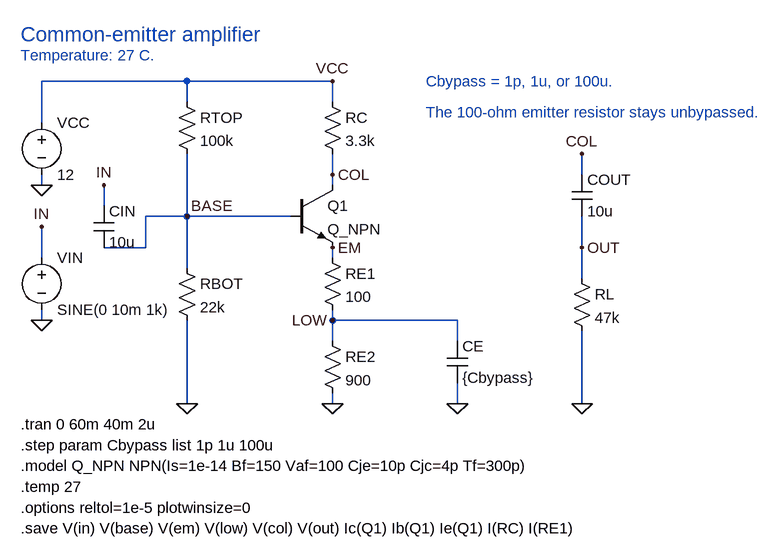
[diagram p0: schematic common-emitter-amplifier.asc]
common-emitter-amplifier.asc, the LTspice schematic file:
Version 4
SHEET 1 1280 1000
WIRE 80 160 80 96
WIRE 80 96 304 96
WIRE 304 96 528 96
WIRE 528 96 528 128
WIRE 304 96 304 128
WIRE 80 240 80 256
WIRE 304 208 304 304
WIRE 304 304 464 304
WIRE 304 304 304 384
WIRE 176 288 176 256
WIRE 176 352 240 352
WIRE 240 352 240 304
WIRE 240 304 304 304
WIRE 80 368 80 320
WIRE 80 448 80 464
WIRE 528 208 528 240
WIRE 528 240 528 256
WIRE 528 352 528 368
WIRE 528 448 528 464
WIRE 528 464 720 464
WIRE 720 464 720 496
WIRE 528 464 528 496
WIRE 912 240 912 208
WIRE 912 304 912 400
WIRE 304 464 304 592
WIRE 528 576 528 592
WIRE 720 560 720 592
WIRE 912 480 912 592
FLAG 528 96 VCC
FLAG 80 256 0
FLAG 304 304 BASE
FLAG 176 256 IN
FLAG 80 320 IN
FLAG 80 464 0
FLAG 528 240 COL
FLAG 528 352 EM
FLAG 528 464 LOW
FLAG 912 208 COL
FLAG 912 352 OUT
FLAG 304 592 0
FLAG 528 592 0
FLAG 720 592 0
FLAG 912 592 0
SYMBOL voltage 80 144 R0
SYMATTR InstName VCC
SYMATTR Value 12
SYMBOL voltage 80 352 R0
SYMATTR InstName VIN
SYMATTR Value SINE(0 10m 1k)
SYMBOL res 288 112 R0
SYMATTR InstName RTOP
SYMATTR Value 100k
SYMBOL res 288 368 R0
SYMATTR InstName RBOT
SYMATTR Value 22k
SYMBOL cap 160 288 R0
SYMATTR InstName CIN
SYMATTR Value 10u
SYMBOL res 512 112 R0
SYMATTR InstName RC
SYMATTR Value 3.3k
SYMBOL npn 464 256 R0
SYMATTR InstName Q1
SYMATTR Value Q_NPN
SYMBOL res 512 352 R0
SYMATTR InstName RE1
SYMATTR Value 100
SYMBOL res 512 480 R0
SYMATTR InstName RE2
SYMATTR Value 900
SYMBOL cap 704 496 R0
SYMATTR InstName CE
SYMATTR Value {Cbypass}
SYMBOL cap 896 240 R0
SYMATTR InstName COUT
SYMATTR Value 10u
SYMBOL res 896 384 R0
SYMATTR InstName RL
SYMATTR Value 47k
TEXT 48 24 Left 3 ;Common-emitter amplifier
TEXT 48 56 Left 2 ;Temperature: 27 C.
TEXT 672 96 Left 2 ;Cbypass = 1p, 1u, or 100u.
TEXT 672 144 Left 2 ;The 100-ohm emitter resistor stays unbypassed.
TEXT 48 624 Left 2 !.tran 0 60m 40m 2u
TEXT 48 656 Left 2 !.step param Cbypass list 1p 1u 100u
TEXT 48 688 Left 2 !.model Q_NPN NPN(Is=1e-14 Bf=150 Vaf=100 Cje=10p Cjc=4p Tf=300p)
TEXT 48 720 Left 2 !.temp 27
TEXT 48 752 Left 2 !.options reltol=1e-5 plotwinsize=0
TEXT 48 784 Left 2 !.save V(in) V(base) V(em) V(low) V(col) V(out) Ic(Q1) Ib(Q1) Ie(Q1) I(RC) I(RE1)

The netlist it stands for:
* common-emitter-amplifier.asc
VCC VCC 0 12
VIN IN 0 SINE(0 10m 1k)
RTOP VCC BASE 100k
RBOT BASE 0 22k
CIN IN BASE 10u
RC VCC COL 3.3k
Q1 COL BASE EM 0 Q_NPN
RE1 EM LOW 100
RE2 LOW 0 900
CE LOW 0 {Cbypass}
COUT COL OUT 10u
RL OUT 0 47k
.model NPN NPN
.model PNP PNP
.lib standard.bjt
* Common-emitter amplifier
* Temperature: 27 C.
* Cbypass = 1p, 1u, or 100u.
* The 100-ohm emitter resistor stays unbypassed.
.tran 0 60m 40m 2u
.step param Cbypass list 1p 1u 100u
.model Q_NPN NPN(Is=1e-14 Bf=150 Vaf=100 Cje=10p Cjc=4p Tf=300p)
.temp 27
.options reltol=1e-5 plotwinsize=0
.save V(in) V(base) V(em) V(low) V(col) V(out) Ic(Q1) Ib(Q1) Ie(Q1) I(RC) I(RE1)
.backanno
.end